# EAGLE design 1wireESP (EAGLE 7.3.0)
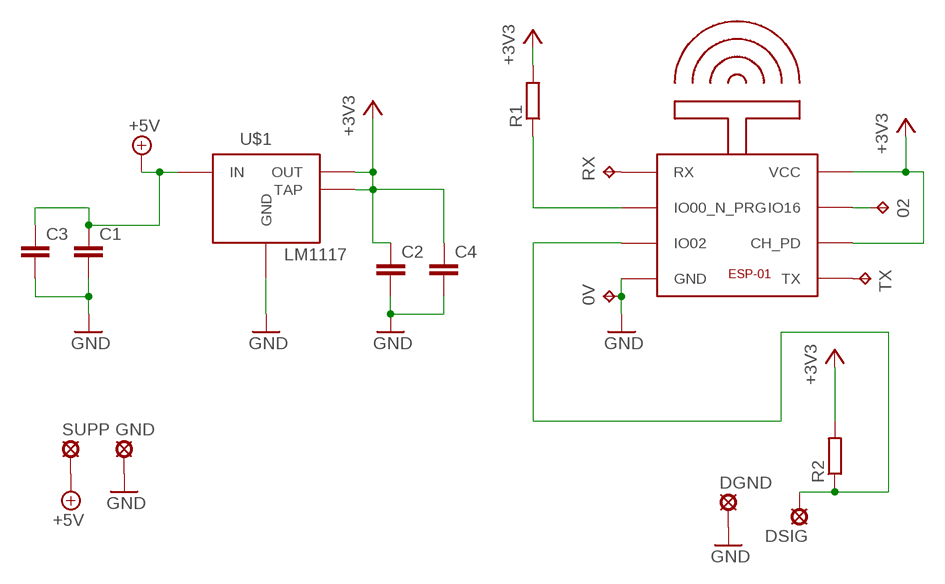
[diagram p0: schematic, sheet 1]

## Parts
0V  TPB2,54  [B2,54]
02  TPB2,54  [B2,54]
C1  C-EUC0603K  [C0603K]
C2  C-EUC0603K  [C0603K]
C3  C-EUC0805K  [C0805K]
C4  C-EUC0805K  [C0805K]
DGND  LSP10  [LSP10]
DSIG  LSP10  [LSP10]
GND  LSP10  [LSP10]
R1  R-EU_R0603  [R0603]
R2  R-EU_R0603  [R0603]
RX  TPB2,54  [B2,54]
SUPP  LSP10  [LSP10]
TX  TPB2,54  [B2,54]
U$1  LM1117  [SOT223]
U$2  ESP-01  [ESP-01]

## Nets
+3V3: C2.1 C4.1 R1.2 R2.2 U$1.MID(OUT) U$1.TAP U$2.CH_PD U$2.VCC
+5V: C1.1 C3.1 SUPP.MP U$1.RIGHT(IN)
GND: 0V.TP C1.2 C2.2 C3.2 C4.2 DGND.MP GND.MP U$1.LEFT(GND) U$2.GND
N$1: R1.1 U$2.GPIO0_N_PROG(IO00_N_PRG)
N$3: 02.TP U$2.GPIO16(IO16)
N$4: DSIG.MP R2.1 U$2.GPIO02(IO02)
N$7: TX.TP U$2.TX
N$8: RX.TP U$2.RX

## Library data of the parts
0V 02 RX TX = testpad:TP: Test pad
C1-C4 = rcl:C-EU: CAPACITOR, European symbol
DGND DSIG GND SUPP = solpad:LSP10: SOLDER PAD drill 1.0 mm, distributor Buerklin, 12H555
R1 R2 = rcl:R-EU_: RESISTOR, European symbol
U$1 = Fabian:LM1117: lm1117 from National semi, buy from onlinecomponents.com add at least 10 uF at output Order No: LM1117MP-3.3
U$2 = Fabian:ESP-01

## Board
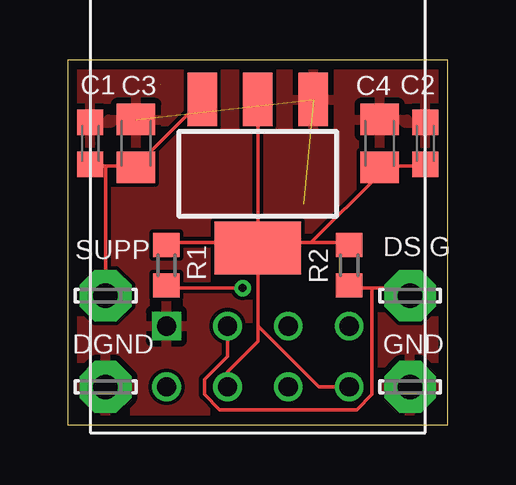
[diagram p1: board, top side]
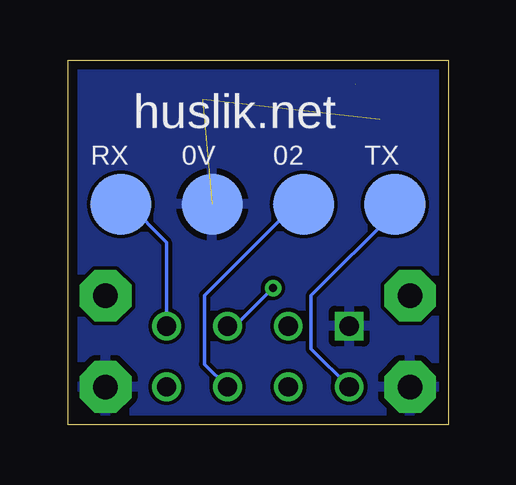
[diagram p2: board, bottom side, seen from below]

Size 15.86 x 15.23 mm. Coordinates in mm from the lower left corner, seen from the top.
Outline: 0,0 15.85,0 15.85,15.23 0,15.23 0,0
Copper layers (1*16): Top 0.0356mm / dielectric 1.5011mm / Bottom 0.0356mm
Design rules "OSHpark-LaenPCBOrder *": minimum track width 6mil, minimum drill 13mil, track to track 6mil, track to pad 6mil, pad to pad 6mil, via to via 6mil, smd to smd 6mil, copper to edge 15mil, drill to drill 6mil, minimum pad ring 7mil, minimum via ring 7mil, stop-mask expansion 3mil, vias tented up to drill 20mil, thermal gap 10mil

### Footprints (pad centres in the part's own frame; a part is rotated, then mirrored left to right if it is on the bottom)
B2,54 = smd 2.54 x 2.54: TP 0,0
C0603K = smd 1.05 x 1.08: 1 -0.875,0; 2 0.875,0
C0805K = smd 1.3 x 1.6: 1 -1,0; 2 1,0
LSP10 = drill 1.016 pad 2.159 octagon: MP 0,0
R0603 = smd 1 x 1.1: 1 -0.85,0; 2 0.85,0
SOT223 = smd 1.219 x 2.235: LEFT -2.311,-3.099; MID 0,-3.099; RIGHT 2.311,-3.099 | smd 3.6 x 2.2: TAP 0,3.099
ESP-01 = drill 0.8: CH_PD 2.54,-2.54; GPIO0_N_PROG 5.08,0; GPIO02 2.54,0; GPIO16 5.08,-2.54; RX 7.62,0; TX 0,-2.54; VCC 7.62,-2.54 | drill 0.8 square: GND 0,0

### Placement (x,y rotation side)
0V  9.84,9.21 0 bottom
02  6.03,9.21 0 bottom
C1  0.95,11.75 90 top
C2  14.92,11.75 90 top
C3  2.86,11.75 90 top
C4  13.02,11.75 90 top
DGND  1.59,1.59 0 top
DSIG  14.29,5.4 0 top
GND  14.29,1.59 0 top
R1  4.13,6.67 90 top
R2  11.75,6.67 90 top
RX  13.65,9.21 0 bottom
SUPP  1.59,5.4 0 top
TX  2.22,9.21 0 bottom
U$1  7.94,10.48 180 top
U$2  4.13,4.13 0 top

### Tracks (layer width: path | path; a pad name or v marks a point on that pad's centre or on a via)
+3V3
  Top 0.152: C2.1 14.92,10.8 13.02,10.8 C4.1 13.02,10.48 10.16,7.62 | 7.94,7.62 4.13,7.62 R1.2 | 7.94,7.62 U$1.TAP | 7.94,7.62 10.16,7.62 | 10.16,7.62 11.75,7.62 R2.2 | 7.94,7.62 U$1.TAP | 7.94,7.62 7.94,13.33 U$1.MID | 7.94,7.62 U$1.TAP | U$2.CH_PD 6.67,2.22 7.94,3.49 7.94,4.13 | 7.94,4.13 7.94,7.3 U$1.TAP | U$2.VCC 10.48,1.59 7.94,4.13
+5V
  Top 0.152: 2.86,10.8 1.59,10.8 | 1.59,10.8 0.95,10.8 C1.1 | 2.86,10.8 C3.1 2.86,10.8 | 2.86,10.8 5.4,13.33 U$1.RIGHT | SUPP.MP 1.59,10.8
GND  (2 unrouted)
  pour Bottom: -0.32,15.56 16.19,15.56 16.19,-0.32 -0.32,-0.32
  pour Top: 0.32,15.56 16.83,15.56 16.83,-0.95 0.32,-0.95
N$1  (via drill 0.33)  (1 unrouted)
  Top 0.152: v7.3,5.72 4.13,5.72 R1.1
  Bottom 0.152: v7.3,5.72 8.89,4.13 U$2.GPIO0_N_PROG
N$3
  Bottom 0.152: U$2.GPIO16 10.16,2.54 10.16,5.4 6.35,9.21 02.TP
N$4
  Top 0.152: 12.7,5.72 13.97,5.72 DSIG.MP | 12.7,5.72 11.75,5.72 R2.1 | U$2.GPIO02 6.67,2.86 5.71,1.9 5.71,1.27 6.35,0.63 12.07,0.63 12.7,1.27 12.7,5.72
N$7
  Bottom 0.152: U$2.TX 5.71,3.18 5.71,5.4 2.22,8.89 TX.TP
N$8
  Bottom 0.152: U$2.RX 11.75,7.62 13.34,9.21 RX.TP

### Text on the board
bPlace: huslik.net